# EAGLE schematic owl analog (EAGLE 6.4)
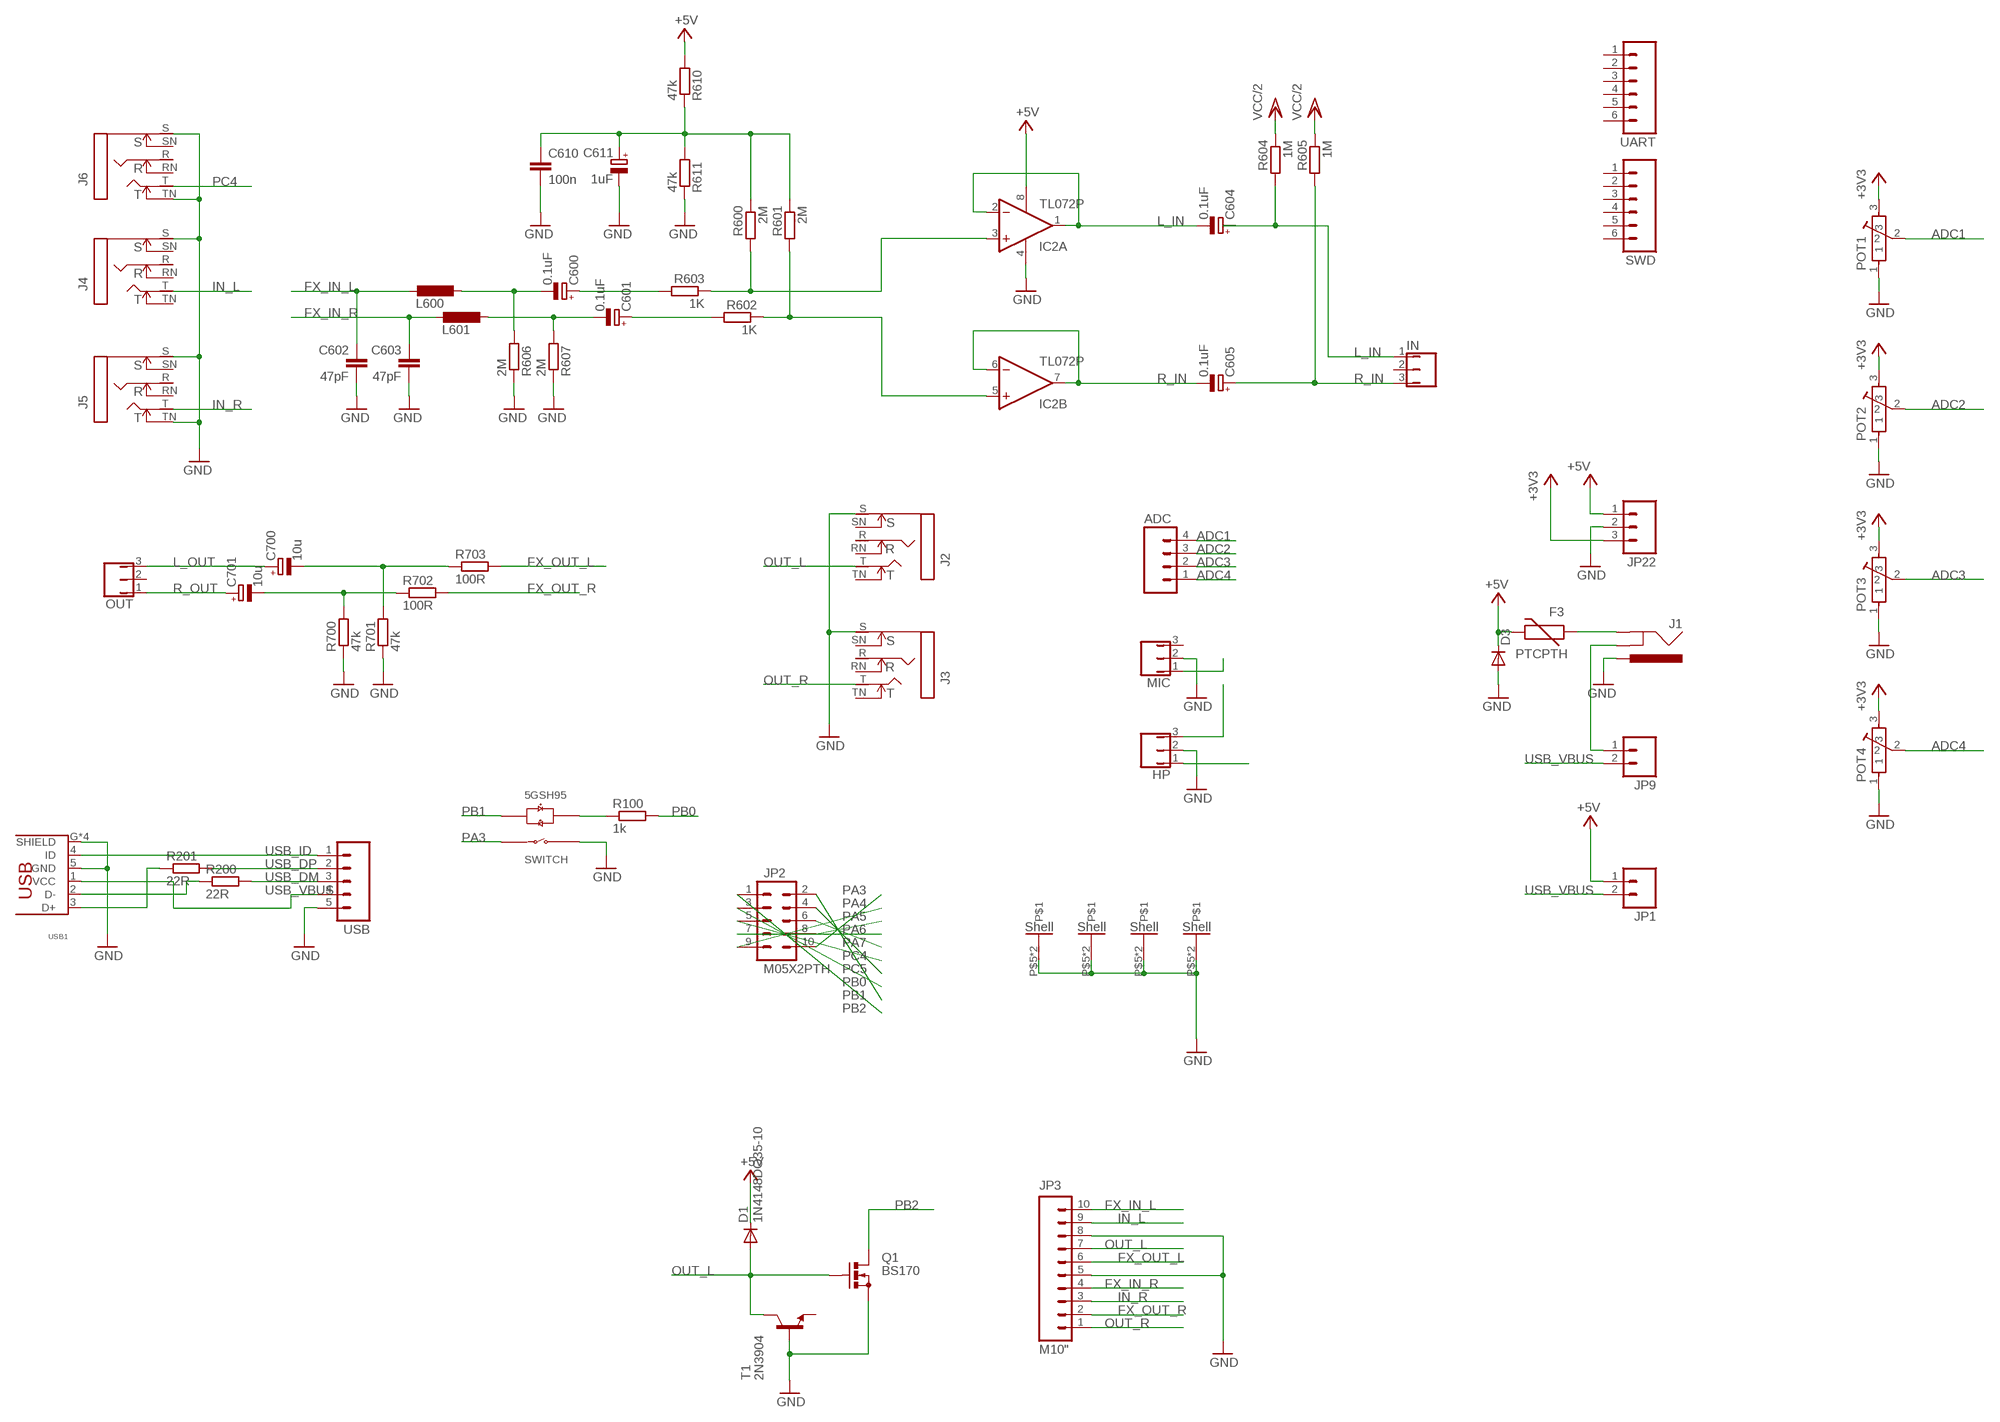
[diagram p0: schematic, sheet 1]

## Parts
ADC  M04PTH  [1X04]
C600  0.1uF  CPOL-EUE2.5-7  [E2,5-7]
C601  0.1uF  CPOL-EUE2.5-7  [E2,5-7]
C602  47pF  C-EU050-025X075  [C050-025X075]
C603  47pF  C-EU050-025X075  [C050-025X075]
C604  0.1uF  CPOL-EUE2.5-7  [E2,5-7]
C605  0.1uF  CPOL-EUE2.5-7  [E2,5-7]
C610  100n  C-EU050-025X075  [C050-025X075]
C611  1uF  CPOL-EUE2.5-7  [E2,5-7]
C700  10u  CPOL-EUE2.5-7  [E2,5-7]
C701  10u  CPOL-EUE2.5-7  [E2,5-7]
D1  1N4148DO35-10  [DO35-10]
D3  DIODE1N4001  [DIODE-1N4001]
F3  PTCPTH  [PTC]
HP  JMP/3P/SIP  [JMP/3P/SIP]
IC2  TL072P  [DIL08]
IN  JMP/3P/SIP  [JMP/3P/SIP]
J1  POWER_JACKPTH  [POWER_JACK_PTH]
J2  NEUTRIK_NMJ6HCD2  [NMJ6HCD2]
J3  NEUTRIK_NMJ6HCD2  [NMJ6HCD2]
J4  NEUTRIK_NMJ6HCD2  [NMJ6HCD2]
J5  NEUTRIK_NMJ6HCD2  [NMJ6HCD2]
J6  NEUTRIK_NMJ6HCD2  [NMJ6HCD2]
JP1  M02PTH  [1X02]
JP2  M05X2PTH  [AVR_ICSP]
JP3  M10"  [1X10]
JP9  M02PTH  [1X02]
JP22  M03PTH  [1X03]
L600  L-EUIRF-1  [IRF-1]
L601  L-EUIRF-1  [IRF-1]
MIC  JMP/3P/SIP  [JMP/3P/SIP]
OUT  JMP/3P/SIP  [JMP/3P/SIP]
POT1  POT-ALPS-RK09L1140  [POT-ALPS-RK09L1140]
POT2  POT-ALPS-RK09L1140  [POT-ALPS-RK09L1140]
POT3  POT-ALPS-RK09L1140  [POT-ALPS-RK09L1140]
POT4  POT-ALPS-RK09L1140  [POT-ALPS-RK09L1140]
Q1  BS170  [SOT54E]
R100  1k  R-EU_0204/7  [0204/7]
R200  22R  R-EU_0204/7  [0204/7]
R201  22R  R-EU_0204/7  [0204/7]
R600  2M  R-EU_0204/7  [0204/7]
R601  2M  R-EU_0204/7  [0204/7]
R602  1K  R-EU_0204/7  [0204/7]
R603  1K  R-EU_0204/7  [0204/7]
R604  1M  R-EU_0204/7  [0204/7]
R605  1M  R-EU_0204/7  [0204/7]
R606  2M  R-EU_0204/7  [0204/7]
R607  2M  R-EU_0204/7  [0204/7]
R610  47k  R-EU_0204/7  [0204/7]
R611  47k  R-EU_0204/7  [0204/7]
R700  47k  R-EU_0204/7  [0204/7]
R701  47k  R-EU_0204/7  [0204/7]
R702  100R  R-EU_0204/7  [0204/7]
R703  100R  R-EU_0204/7  [0204/7]
SWD  M06SIP  [1X06]
T1  2N3904  [TO92]
U$1  5GTH9  [5GTH9]
UART  M06SIP  [1X06]
USB  M05PTH  [1X05]
USB1  USB_HRS_ZX62-B-5PA(11)MICRO.B-  [HRS_ZX62D-AB-5P8_USB]

## Nets
+3V3: JP22.3 POT1.3 POT2.3 POT3.3 POT4.3
+5V: D1.C D3.C F3.P$2 IC2.8(P:V+) JP1.1 JP22.1 R610.2
ADC1: ADC.4 POT1.2
ADC2: ADC.3 POT2.2
ADC3: ADC.2 POT3.2
ADC4: ADC.1 POT4.2
FX_IN_L: C602.1 JP3.10 L600.2
FX_IN_R: C603.1 JP3.4 L601.2
FX_OUT_L: JP3.6 R703.2
FX_OUT_R: JP3.2 R702.2
GND: C602.2 C603.2 C610.2 C611.- D3.A HP.2 IC2.4(P:V-) J1.PWR J2.S J3.S J4.S J5.S J5.TN J6.S J6.TN JP3.5 JP22.2 MIC.2 POT1.1 POT1.P$5 POT1.P$6 POT2.1 POT2.P$5 POT2.P$6 POT3.1 POT3.P$5 POT3.P$6 POT4.1 POT4.P$5 POT4.P$6 Q1.S R606.1 R607.1 R611.1 R700.1 R701.1 T1.2(B) U$1.+3(3+) USB1.5(GND) USB1.G2(SHIELD) USB1.G3(SHIELD) USB1.G4(SHIELD) USB1.G(SHIELD) USB.5
IN_L: J4.T JP3.9
IN_R: J5.T JP3.3
L_IN: C604.- IC2.1(A:OUT) IC2.2(A:-IN) IN.1 R604.2
L_OUT: C700.+ OUT.3
N$1: R201.1 USB1.3(D+)
N$2: C600.- L600.1 R606.2
N$3: C601.- L601.1 R607.2
N$4: F3.P$1 J1.GND
N$5: J1.GNDBREAK JP9.1
N$6: R200.1 USB1.2(D-)
N$7: C600.+ R603.2
N$8: HP.3
N$9: C601.+ R602.2
N$10: R100.1 U$1.1
N$18: C610.1 C611.+ R600.1 R601.1 R610.1 R611.2
N$33: C701.- R700.2 R702.1
N$36: C700.- R701.2 R703.1
N$37: IC2.3(A:+IN) R600.2 R603.1
N$38: IC2.5(B:+IN) R601.2 R602.1
N$43: MIC.1
N$44: HP.1
OUT_L: D1.A J2.T JP3.7 Q1.G T1.1(C)
OUT_R: J3.T JP3.1
PA3: JP2.10 U$1.4
PA4: JP2.9
PA5: JP2.8
PA6: JP2.7
PA7: JP2.6
PB0: JP2.3 R100.2
PB1: JP2.2 U$1.-2
PB2: JP2.1 Q1.D
PC4: J6.T JP2.5
PC5: JP2.4
R_IN: C605.+ C605.- IC2.6(B:-IN) IC2.7(B:OUT) IN.3 R605.2
R_OUT: C701.+ OUT.1
USB_DM: R200.2 USB.3
USB_DP: R201.2 USB.2
USB_ID: USB1.4(ID) USB.1
USB_VBUS: JP1.2 JP9.2 USB1.1(VCC) USB.4
VCC/2: R604.1 R605.1
Unconnected: C604.+ IN.2 J2.R J2.RN J2.SN J2.TN J3.R J3.RN J3.SN J3.TN J4.R J4.RN J4.SN J4.TN J5.R J5.RN J5.SN J6.R J6.RN J6.SN JP3.8 MIC.3 OUT.2 SWD.1 SWD.2 SWD.3 SWD.4 SWD.5 SWD.6 T1.3(E) UART.1 UART.2 UART.3 UART.4 UART.5 UART.6

## Library data of the parts
ADC = SparkFun:M04: Header 4 Standard 4-pin 0.1" header. Use with straight break away headers (SKU : PRT-00116), right angle break away headers (PRT-00553), swiss pins (PRT-00743), machine pins (PRT-00117), and female headers (PRT-00115). Molex polarized connector foot print use with SKU : PRT-08231 with associated crimp pins and housings. 1MM SMD Version SKU: PRT-10208
C600 C601 C604 C605 C611 C700 C701 = rcl:CPOL-EU: POLARIZED CAPACITOR, European symbol
C602 C603 C610 = rcl:C-EU: CAPACITOR, European symbol
D1 = diode:1N4148: DIODE high speed (Philips)
D3 = Rebel:DIODE: Diode These are standard reverse protection diodes and small signal diodes. SMA package can handle up to about 1A. SOD-323 can handle about 200mA. Watch the SOD-323 package when ordering, there are some mfgs out there that are 5-pin packages.
F3 = Rebel:PTC: Resettable Fuse PTC Resettable Fuse. Bourns MF-R, Raychem PolySwitch RXE.
HP IN MIC OUT = audioint:JMP/3P/SIP
IC2 = linear:TL072: OP AMP
J1 = SparkFun:POWER_JACK: Power Jack This is the standard 5.5mm barrel jack for power. The PTH is the most common, proven, reliable, footprint. All others are experimental. The Slot footprint only works if the mill layer is transmitted to the PCB fab house so be warned. Spark Fun Electronics SKU : PRT-00119. Mating wall wart : TOL-00298 (and others)
J2-J6 = neutrik_jacks:NEUTRIK_NMJ6HCD2
JP1 JP9 = SparkFun:M02: Header 2 Standard 2-pin 0.1" header. Use with straight break away headers (SKU : PRT-00116), right angle break away headers (PRT-00553), swiss pins (PRT-00743), machine pins (PRT-00117), and female headers (PRT-00115). Molex polarized connector foot print use with SKU : PRT-08233 with associated crimp pins and housings.
JP2 = SparkFun:M05X2: Header 5x2 Standard 10-pin dual row 0.1" header. Commonly used with AVR-ISP. Use with Spark Fun Electronics SKU: PRT-00778
JP3 = SparkFun:M10: Header 10 Standard 10-pin 0.1" header. Use with straight break away headers (SKU : PRT-00116), right angle break away headers (PRT-00553), swiss pins (PRT-00743), machine pins (PRT-00117), and female headers (PRT-00115).
JP22 = SparkFun:M03: Header 3 Standard 3-pin 0.1" header. Use with straight break away headers (SKU : PRT-00116), right angle break away headers (PRT-00553), swiss pins (PRT-00743), machine pins (PRT-00117), and female headers (PRT-00115). Molex polarized connector foot print use with SKU : PRT-08232 with associated crimp pins and housings.
L600 L601 = rcl:L-EU: INDUCTOR, European symbol
POT1-POT4 = Rebel:POT-ALPS-RK09L
Q1 = transistor-small-signal:BS170: N-CHANNEL MOS FET
R100 R200 R201 R600-R607 R610 R611 R700-R703 = Rebel:R-EU_: RESISTOR, European symbol
SWD UART = SparkFun:M06: Header 6 Standard 6-pin 0.1" header. Use with straight break away headers (SKU : PRT-00116), right angle break away headers (PRT-00553), swiss pins (PRT-00743), machine pins (PRT-00117), and female headers (PRT-00115). Molex polarized connector foot print use with SKU : PRT-08094 with associated crimp pins and housings. NOTES ON THE VARIANTS LOCK and LOCK_LONGPADS... This footprint was designed to help hold the alignment of a through-hole component (i.e. 6-pin header) while soldering it into place. You may notice that each hole has been shifted either up or down by 0.005 of an inch from it's more standard position (which is a perfectly straight line). This slight alteration caused the pins (the squares in the middle) to touch the edges of the holes. Because they are alternating, it causes a "brace" to hold the component in place. 0.005 has proven to be the perfect amount of "off-center" position when using our standard breakaway headers. Although looks a little odd when you look at the bare footprint, once you have a header in there, the alteration is very hard to notice. Also, if you push a header all the way into place, it is covered up entirely on the bottom side. This idea of altering the position of holes to aid alignment will be further integrated into the Sparkfun Library for other footprints. It can help hold any component with 3 or more connection pins.
T1 = transistor:2N3904: NPN TRANSISTOR
U$1 = SWITCH-5GTH9:5GTH9
USB = SparkFun:M05: Header 5 Standard 5-pin 0.1" header. Use with straight break away headers (SKU : PRT-00116), right angle break away headers (PRT-00553), swiss pins (PRT-00743), machine pins (PRT-00117), and female headers (PRT-00115). Molex polarized connector foot print use with SKU : PRT-08230 with associated crimp pins and housings.
USB1 = USB_connector:USB_HRS_ZX62-B-5PA(11)MICRO.B